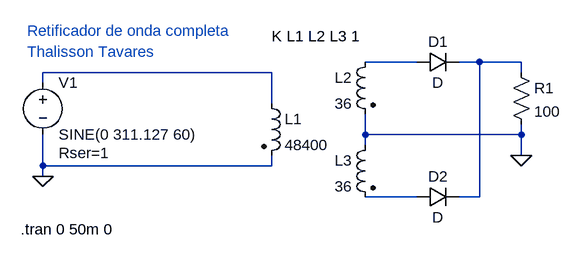
[diagram p0: schematic P1 - Full Wave Rectifier.asc]
P1 - Full Wave Rectifier.asc, the LTspice schematic file:
Version 4
SHEET 1 880 680
WIRE 624 96 544 96
WIRE 720 96 688 96
WIRE 784 96 720 96
WIRE 400 112 48 112
WIRE 784 112 784 96
WIRE 48 128 48 112
WIRE 400 160 400 112
WIRE 544 208 544 176
WIRE 784 208 784 192
WIRE 784 208 544 208
WIRE 544 224 544 208
WIRE 784 240 784 208
WIRE 48 256 48 208
WIRE 400 256 400 240
WIRE 400 256 48 256
WIRE 48 272 48 256
WIRE 624 304 544 304
WIRE 720 304 720 96
WIRE 720 304 688 304
FLAG 48 272 0
FLAG 784 240 0
SYMBOL voltage 48 112 R0
WINDOW 123 0 0 Left 0
WINDOW 39 24 124 Left 2
SYMATTR InstName V1
SYMATTR Value SINE(0 311.127 60)
SYMATTR SpiceLine Rser=1
SYMBOL ind2 384 144 R0
SYMATTR InstName L1
SYMATTR Value 48400
SYMATTR Type ind
SYMBOL ind2 560 80 M0
SYMATTR InstName L2
SYMATTR Value 36
SYMATTR Type ind
SYMBOL ind2 560 208 M0
SYMATTR InstName L3
SYMATTR Value 36
SYMATTR Type ind
SYMBOL diode 624 112 R270
WINDOW 0 32 32 VTop 2
WINDOW 3 0 32 VBottom 2
SYMATTR InstName D1
SYMBOL diode 624 320 R270
WINDOW 0 32 32 VTop 2
WINDOW 3 0 32 VBottom 2
SYMATTR InstName D2
SYMBOL res 768 96 R0
SYMATTR InstName R1
SYMATTR Value 100
TEXT 400 56 Left 2 !K L1 L2 L3 1
TEXT 24 48 Left 2 ;Retificador de onda completa
TEXT 24 80 Left 2 ;Thalisson Tavares
TEXT 14 354 Left 2 !.tran 0 50m 0

The netlist it stands for:
* P1 - Full Wave Rectifier.asc
V1 N003 0 SINE(0 311.127 60) Rser=1
L1 N003 0 48400
L2 N001 0 36
L3 0 N004 36
D1 N001 N002 D
D2 N004 N002 D
R1 N002 0 100
.model D D
.lib standard.dio
K L1 L2 L3 1
* Retificador de onda completa
* Thalisson Tavares
.tran 0 50m 0
.backanno
.end